# Altium project M-Mewtwo_MCUrev1.PrjPcb
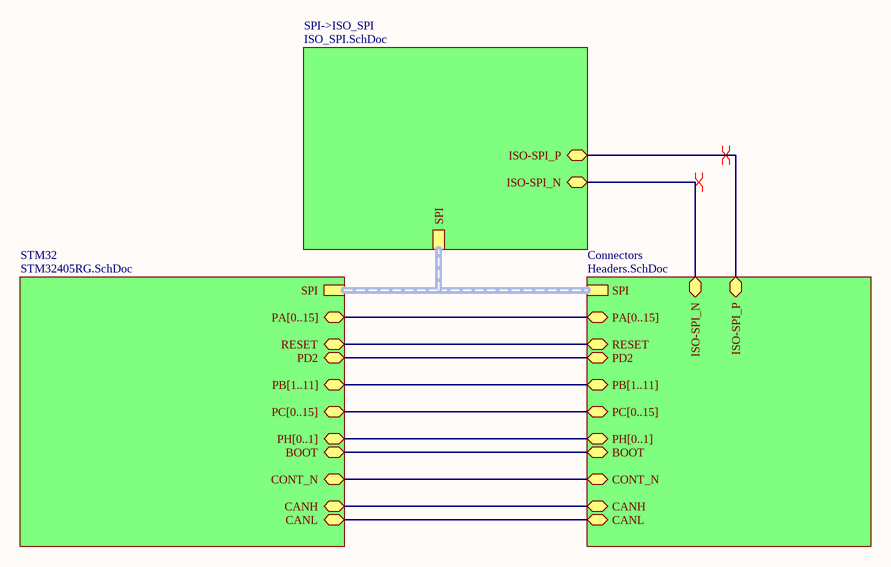
[diagram p0: MCU.SchDoc]
4 sheets, 39 parts. Net scope: hierarchical (ports join the sheet entries above them; power ports are global).
Board file: MCU.PcbDoc
Sheets:
  MCU.SchDoc
    STM32 = STM32405RG.SchDoc
    Connectors = Headers.SchDoc
    SPI->ISO_SPI = ISO_SPI.SchDoc

## Sheet MCU.SchDoc
size A

### Sub-sheets
Connectors = Headers.SchDoc: PA[0..15] (bidir), RESET (bidir), PB[1..11] (bidir), PC[0..15] (bidir), PH[0..1] (bidir), PD2 (bidir), SPI (harness SPI), BOOT (bidir), ISO-SPI_P (bidir), ISO-SPI_N (bidir), CONT_N (bidir), CANH (bidir), CANL (bidir)
SPI->ISO_SPI = ISO_SPI.SchDoc: SPI (harness SPI), ISO-SPI_N (bidir), ISO-SPI_P (bidir)
STM32 = STM32405RG.SchDoc: PA[0..15] (bidir), PB[1..11] (bidir), RESET (bidir), PC[0..15] (bidir), PH[0..1] (bidir), PD2 (bidir), SPI (harness SPI), CONT_N (bidir), BOOT (bidir), CANH (bidir), CANL (bidir)

### Nets
BOOT: sheet STM32/BOOT, sheet Connectors/BOOT
CANH: sheet STM32/CANH, sheet Connectors/CANH
CANL: sheet STM32/CANL, sheet Connectors/CANL
CONT_N: sheet STM32/CONT_N, sheet Connectors/CONT_N
ISO-SPI_N: sheet Connectors/ISO-SPI_N, sheet SPI->ISO_SPI/ISO-SPI_N
ISO-SPI_P: sheet Connectors/ISO-SPI_P, sheet SPI->ISO_SPI/ISO-SPI_P
PD2: sheet STM32/PD2, sheet Connectors/PD2
NetC13_1: sheet STM32/RESET, sheet Connectors/RESET

### Buses and harness runs
bus sheet Connectors/PA[0..15] = sheet STM32/PA[0..15]
bus sheet Connectors/PB[1..11] = sheet STM32/PB[1..11]
bus sheet Connectors/PC[0..15] = sheet STM32/PC[0..15]
bus sheet Connectors/PH[0..1] = sheet STM32/PH[0..1]
harness sheet Connectors/SPI = sheet SPI->ISO_SPI/SPI = sheet STM32/SPI

### Layout directives
differential pair: ISO-SPI_N, ISO-SPI_P

## Sheet STM32405RG.SchDoc
size A
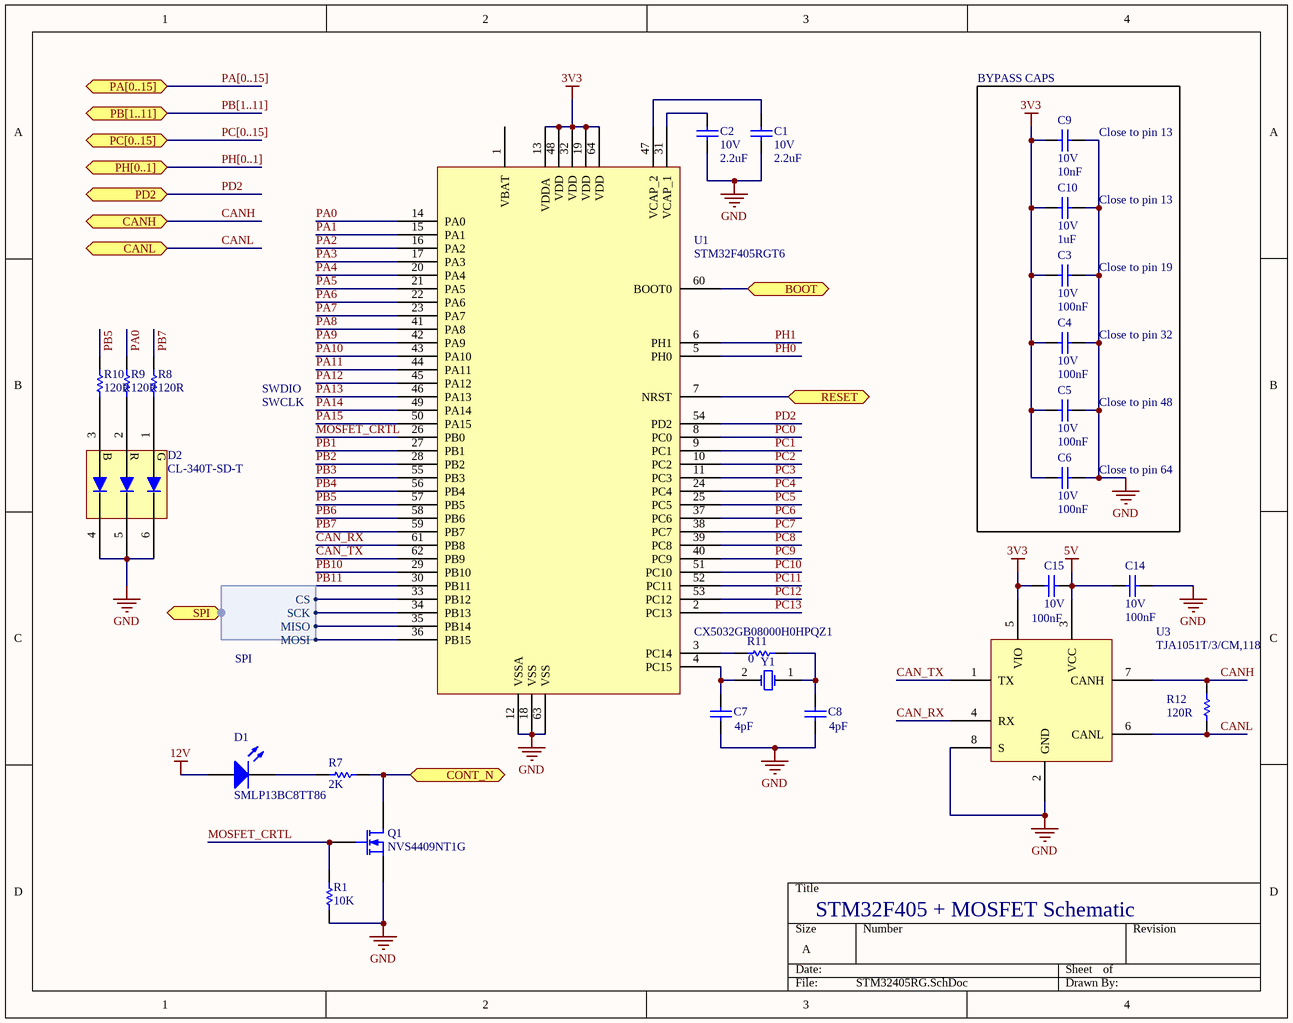
[diagram p1: STM32405RG.SchDoc]

### Parts
C1  10V  value 2.2uF  [C0805]
C2  10V  value 2.2uF  [C0805]
C3  10V  value 100nF  [C0805]
C4  10V  value 100nF  [C0805]
C5  10V  value 100nF  [C0805]
C6  10V  value 100nF  [C0805]
C7  value 4pF  [C0805]  (hidden comment: 50V)
C8  value 4pF  [C0805]  (hidden comment: 50V)
C9  10V  value 10nF  [C0805]
C10  10V  value 1uF  [C0805]
C14  10V  value 100nF  [C0805]
C15  10V  value 100nF  [C0805]
D1  SMLP13BC8TT86  [SMLP13BC8TT86]
D2  CL-340T-SD-T  [CL-340T-SD-T]
Q1  NVS4409NT1G  [NVS4409NT1G]
R1  value 10K  [J1-0603]  (hidden comment: 5%)
R7  value 2K  [J1-0603]  (hidden comment: 5%)
R8  value 120R  [J1-0603]  (hidden comment: 1%)
R9  value 120R  [J1-0603]  (hidden comment: 1%)
R10  value 120R  [J1-0603]  (hidden comment: 1%)
R11  value 0  [J1-0603]  (hidden comment: 0603)
R12  value 120R  [J1-0603]  (hidden comment: 1%)
U1  STM32F405RGT6  [STM32F405RGT6TR]
U3  TJA1051T/3/CM,118
Y1  CX5032GB08000H0HPQZ1  [CX5032GB08000H0HPQZ1]

### Ports
BOOT (bidir), CANH (bidir), CANL (bidir), CONT_N (bidir), PA[0..15] (bidir), PB[1..11] (bidir), PC[0..15] (bidir), PD2 (bidir), PH[0..1] (bidir), RESET (bidir), SPI (bidir, harness SPI)

### Harnesses
SPI: CS, SCK, MISO, MOSI

### Nets
3V3: C3.1 C4.1 C5.1 C6.1 C9.1 C10.2 C15.1 U1.13(VDDA) U1.19(VDD) U1.32(VDD) U1.48(VDD) U1.64(VDD) U3.5(VIO)
5V: C14.1 C15.2 U3.3(VCC)
12V: D1.1(A)
GND: C1.1 C2.1 C3.2 C4.2 C5.2 C6.2 C7.1 C8.1 C9.2 C10.1 C14.2 D2.4 D2.5 D2.6 Q1.3(S) R1.1 U1.12(VSSA) U1.18(VSS) U1.63(VSS) U3.2(GND) U3.8(S)
BOOT: U1.60(BOOT0) ; port BOOT
CAN_RX: U1.61(PB8) U3.4(RX)
CAN_TX: U1.62(PB9) U3.1(TX)
CANH: R12.2 U3.7(CANH) ; port CANH
CANL: R12.1 U3.6(CANL) ; port CANL
CONT_N: Q1.1(D) R7.1 ; port CONT_N
MOSFET_CRTL: Q1.2(G) R1.2 U1.26(PB0)
PA0: R9.2 U1.14(PA0)
PA1: U1.15(PA1)
PA2: U1.16(PA2)
PA3: U1.17(PA3)
PA4: U1.20(PA4)
PA5: U1.21(PA5)
PA6: U1.22(PA6)
PA7: U1.23(PA7)
PA8: U1.41(PA8)
PA9: U1.42(PA9)
PA10: U1.43(PA10)
PA11: U1.44(PA11)
PA12: U1.45(PA12)
PA13: U1.46(PA13)
PA14: U1.49(PA14)
PA15: U1.50(PA15)
PB1: U1.27(PB1)
PB2: U1.28(PB2)
PB3: U1.55(PB3)
PB4: U1.56(PB4)
PB5: R10.2 U1.57(PB5)
PB6: U1.58(PB6)
PB7: R8.2 U1.59(PB7)
PB10: U1.29(PB10)
PB11: U1.30(PB11)
PC0: U1.8(PC0)
PC1: U1.9(PC1)
PC2: U1.10(PC2)
PC3: U1.11(PC3)
PC4: U1.24(PC4)
PC5: U1.25(PC5)
PC6: U1.37(PC6)
PC7: U1.38(PC7)
PC8: U1.39(PC8)
PC9: U1.40(PC9)
PC10: U1.51(PC10)
PC11: U1.52(PC11)
PC12: U1.53(PC12)
PC13: U1.2(PC13)
PD2: U1.54(PD2) ; port PD2
PH0: U1.5(PH0)
PH1: U1.6(PH1)
NetC1_2: C1.2 U1.47(VCAP_2)
NetC2_2: C2.2 U1.31(VCAP_1)
NetC7_2: C7.2 U1.4(PC15) Y1.2(OSC2)
NetC8_2: C8.2 R11.2 Y1.1(OSC1)
NetC13_1: U1.7(NRST) ; port RESET
NetD1_2: D1.2(K) R7.2
NetD2_1: D2.1 R8.1
NetD2_2: D2.2 R9.1
NetD2_3: D2.3 R10.1
NetP1_9: U1.33(PB12) ; port SPI.CS
NetP1_10: U1.34(PB13) ; port SPI.SCK
NetP1_11: U1.35(PB14) ; port SPI.MISO
NetP1_12: U1.36(PB15) ; port SPI.MOSI
NetR11_1: R11.1 U1.3(PC14)

Not connected (* = marked no-connect by the designer): U1 1(VBAT)

### Buses and harness runs
bus PA[0..15] = port PA[0..15]
bus PB[1..11] = port PB[1..11]
bus PC[0..15] = port PC[0..15]
bus PH[0..1] = port PH[0..1]

### Notes on the sheet
- BYPASS CAPS
- (near C9) Close to pin 13
- (near C10) Close to pin 13
- (near C3) Close to pin 19
- (near C4) Close to pin 32
- SWCLK
- SWDIO
- (near C5) Close to pin 48
- (near C6) Close to pin 64
- STM32F405 + MOSFET Schematic
- (in symbol CL-340T-SD-T) B; R; G

### Library data of the parts
C1 C2 = Cap: C0805C225K8RACAUTO. 2.2µF ±10% 10V Ceramic Capacitor X7R 0805 (2012 Metric) /; Published: 8-Jun-2000; LatestRevisionDate: 17-Jul-2002; LatestRevisionNote: Re-released for DXP Platform.; PackageReference: RAD-0.3; Publisher: Altium Limited; PackageDescription: Radial Cap, Thru-Hole; 2 Leads; 0.3 in Pin Spacing
C3-C6 C14 C15 = Cap: C0805C104K8RACTU. 0.1µF ±10% 10V Ceramic Capacitor X7R 0805 (2012 Metric) /; Published: 8-Jun-2000; LatestRevisionDate: 17-Jul-2002; LatestRevisionNote: Re-released for DXP Platform.; PackageReference: RAD-0.3; Publisher: Altium Limited; PackageDescription: Radial Cap, Thru-Hole; 2 Leads; 0.3 in Pin Spacing
C7 = Cap: CBR08C409B5GAC. 4pF ±0.1pF 50V Ceramic Capacitor C0G, NP0 0805 (2012 Metric); Published: 8-Jun-2000; LatestRevisionDate: 17-Jul-2002; LatestRevisionNote: Re-released for DXP Platform.; PackageReference: RAD-0.3; Publisher: Altium Limited; PackageDescription: Radial Cap, Thru-Hole; 2 Leads; 0.3 in Pin Spacing
C8 = Cap: CBR08C409B5GAC; Published: 8-Jun-2000; LatestRevisionDate: 17-Jul-2002; LatestRevisionNote: Re-released for DXP Platform.; PackageReference: RAD-0.3; Publisher: Altium Limited; PackageDescription: Radial Cap, Thru-Hole; 2 Leads; 0.3 in Pin Spacing
C9 = Cap: C0805C103K8RAC7800. 10000pF ±10% 10V Ceramic Capacitor X7R 0805 (2012 Metric) /; Published: 8-Jun-2000; LatestRevisionDate: 17-Jul-2002; LatestRevisionNote: Re-released for DXP Platform.; PackageReference: RAD-0.3; Publisher: Altium Limited; PackageDescription: Radial Cap, Thru-Hole; 2 Leads; 0.3 in Pin Spacing
C10 = Cap: CL21B105KPFNNNE. 1µF ±10% 10V Ceramic Capacitor X7R 0805 (2012 Metric) /; Published: 8-Jun-2000; LatestRevisionDate: 17-Jul-2002; LatestRevisionNote: Re-released for DXP Platform.; PackageReference: RAD-0.3; Publisher: Altium Limited; PackageDescription: Radial Cap, Thru-Hole; 2 Leads; 0.3 in Pin Spacing
D1 = LED2: Blue 470nm LED Indication - Discrete 2.9V 2-SMD, No Lead; Published: 8-Jun-2000; LatestRevisionDate: 17-Jul-2002; LatestRevisionNote: Re-released for DXP Platform.; PackageVersion: Feb-2002; PackageReference: 3.2X1.6X1.1; Publisher: Altium Limited; PackageDescription: SM LED; 2 Flat Leads
Q1 = MOSFET-N: N-Channel 25V 700mA (Ta) 280mW (Tj) Surface Mount SC-70-3 (SOT323); Published: 8-Jun-2000; LatestRevisionDate: 17-Jul-2002; LatestRevisionNote: Re-released for DXP Platform.; PackageVersion: 1995/1996; PackageReference: E3; Publisher: Altium Limited; PackageDescription: TO, Flat Index; 3 In-Line, Axial Leads; Body Dia. 4.6mm; Lead Dia. 0.5 mm (max)
R1 = Res1: ERJ-3GEYJ103V. 10 kOhms ±5% 0.1W, 1/10W Chip Resistor 0603 (1608 Metric) Automotive AEC-Q200 Thick Film /; Published: 8-Jun-2000; LatestRevisionDate: 17-Jul-2002; LatestRevisionNote: Re-released for DXP Platform.; PackageReference: AXIAL-0.3; Publisher: Altium Limited; PackageDescription: Axial Device, Thru-Hole; 2 Leads; 0.3 in Pin Spacing
R7 = Res1: ERJ-PA3J202V. 2 kOhms ±5% 0.25W, 1/4W Chip Resistor 0603 (1608 Metric) Automotive AEC-Q200, Pulse Withstanding Thick Film /; Published: 8-Jun-2000; LatestRevisionDate: 17-Jul-2002; LatestRevisionNote: Re-released for DXP Platform.; PackageReference: AXIAL-0.3; Publisher: Altium Limited; PackageDescription: Axial Device, Thru-Hole; 2 Leads; 0.3 in Pin Spacing
R8-R10 R12 = Res1: RC0603FR-07120RL. 120 Ohms ±1% 0.1W, 1/10W Chip Resistor 0603 (1608 Metric) Moisture Resistant Thick Film /; Published: 8-Jun-2000; LatestRevisionDate: 17-Jul-2002; LatestRevisionNote: Re-released for DXP Platform.; PackageReference: AXIAL-0.3; Publisher: Altium Limited; PackageDescription: Axial Device, Thru-Hole; 2 Leads; 0.3 in Pin Spacing
R11 = Res1: ERJ-U030R00V. 0 Ohms Jumper 0.1W, 1/10W Chip Resistor 0603 (1608 Metric) Anti-Sulfur, Automotive AEC-Q200 Thick Film; Published: 8-Jun-2000; LatestRevisionDate: 17-Jul-2002; LatestRevisionNote: Re-released for DXP Platform.; PackageReference: AXIAL-0.3; Publisher: Altium Limited; PackageDescription: Axial Device, Thru-Hole; 2 Leads; 0.3 in Pin Spacing
U1 = STM32F405RGT6TR
U3 = TJA1050T/CM,118
Y1 = XTAL: 8MHz ±20ppm Crystal 12pF 300 Ohms 2-SMD, No Lead /; Published: 8-Jun-2000; LatestRevisionDate: 17-Jul-2002; LatestRevisionNote: Re-released for DXP Platform.; PackageReference: R38; Publisher: Altium Limited; PackageDescription: Crystal, Thru-Hole; 2 Leads; Body 3.1 x 8.2 mm (Dia.xH)

## Sheet Headers.SchDoc
size A
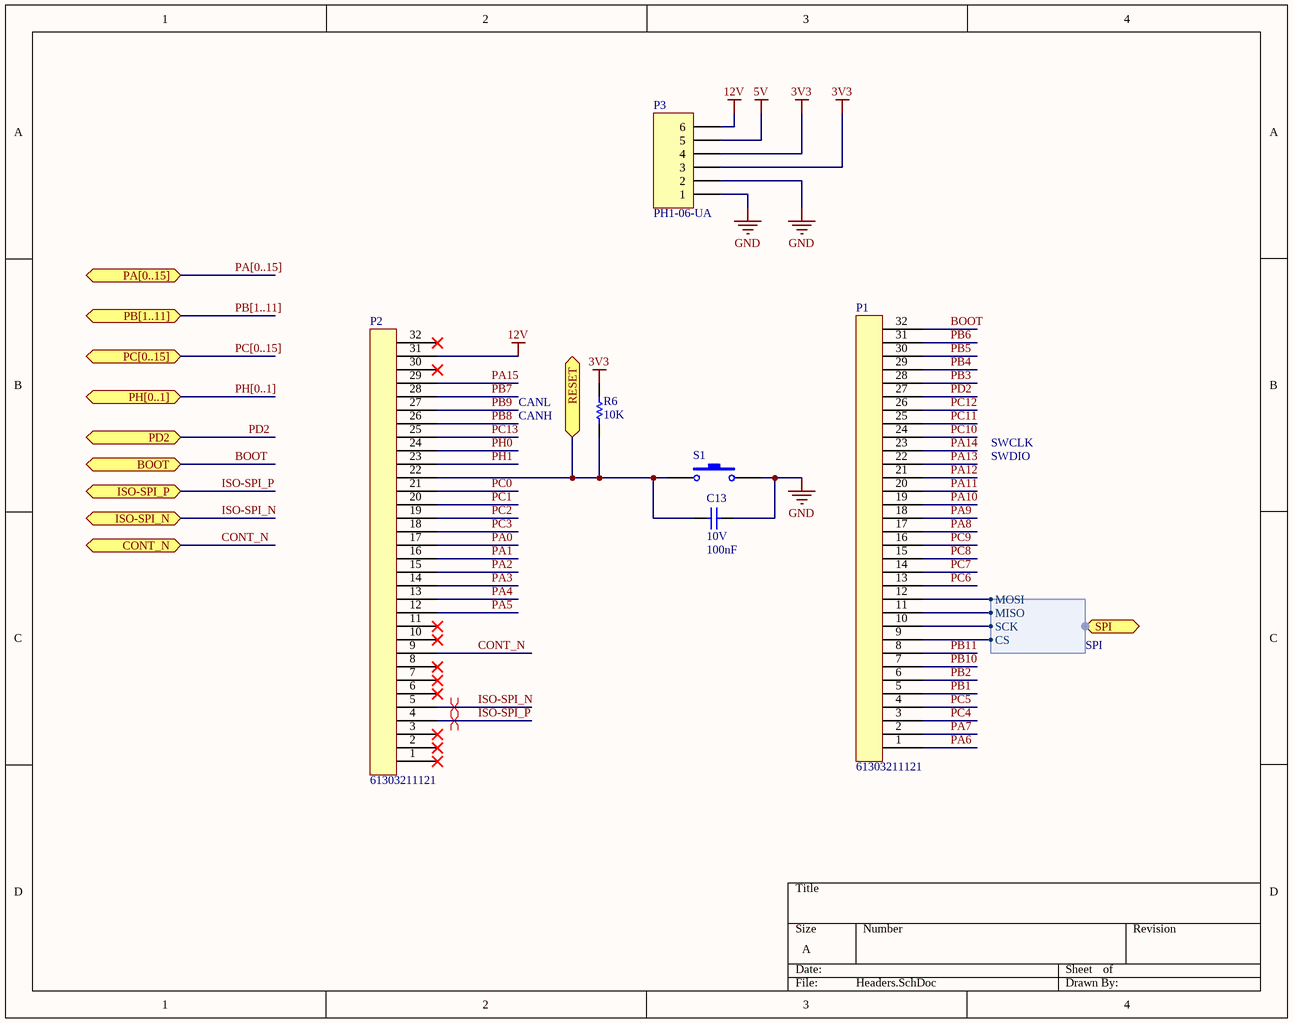
[diagram p2: Headers.SchDoc]

### Parts
C13  10V  value 100nF  [C0805]
P1  61303211121  [61303211121]
P2  61303211121  [61303211121]
P3  PH1-06-UA  [PH1-06-UA]
R6  value 10K  [J1-0603]  (hidden comment: 5%)
S1  PTS636 SM43 SMTR LFS  [PTS636 SM43 SMTR LFS]  (value not drawn)

### Ports
BOOT (bidir), CONT_N (bidir), ISO-SPI_N (bidir), ISO-SPI_P (bidir), PA[0..15] (bidir), PB[1..11] (bidir), PC[0..15] (bidir), PD2 (bidir), PH[0..1] (bidir), RESET (bidir), SPI (bidir, harness SPI)

### Harnesses
SPI: CS, SCK, MISO, MOSI

### Nets
3V3: P3.3 P3.4 R6.2
5V: P3.5
12V: P2.31 P3.6
GND: C13.2 P3.1 P3.2 S1.2
BOOT: P1.32 ; port BOOT
CONT_N: P2.9 ; port CONT_N
ISO-SPI_N: P2.5 ; port ISO-SPI_N
ISO-SPI_P: P2.4 ; port ISO-SPI_P
PA0: P2.17
PA1: P2.16
PA2: P2.15
PA3: P2.14
PA4: P2.13
PA5: P2.12
PA6: P1.1
PA7: P1.2
PA8: P1.17
PA9: P1.18
PA10: P1.19
PA11: P1.20
PA12: P1.21
PA13: P1.22
PA14: P1.23
PA15: P2.29
PB1: P1.5
PB2: P1.6
PB3: P1.28
PB4: P1.29
PB5: P1.30
PB6: P1.31
PB7: P2.28
PB8: P2.26
PB9: P2.27
PB10: P1.7
PB11: P1.8
PC0: P2.21
PC1: P2.20
PC2: P2.19
PC3: P2.18
PC4: P1.3
PC5: P1.4
PC6: P1.13
PC7: P1.14
PC8: P1.15
PC9: P1.16
PC10: P1.24
PC11: P1.25
PC12: P1.26
PC13: P2.25
PD2: P1.27 ; port PD2
PH0: P2.24
PH1: P2.23
NetC13_1: C13.1 P2.22 R6.1 S1.1 ; port RESET
NetP1_9: P1.9 ; port SPI.CS
NetP1_10: P1.10 ; port SPI.SCK
NetP1_11: P1.11 ; port SPI.MISO
NetP1_12: P1.12 ; port SPI.MOSI

Not connected (* = marked no-connect by the designer): P2 1* 2* 3* 6* 7* 8* 10* 11* 30* 32*

### Buses and harness runs
bus PA[0..15] = port PA[0..15]
bus PB[1..11] = port PB[1..11]
bus PC[0..15] = port PC[0..15]
bus PH[0..1] = port PH[0..1]

### Layout directives
differential pair: ISO-SPI_N, ISO-SPI_P

### Notes on the sheet
- CANH
- CANL
- SWDIO
- SWCLK

### Library data of the parts
C13 = Cap: as C3 on sheet STM32405RG; Published: 8-Jun-2000; LatestRevisionDate: 17-Jul-2002; LatestRevisionNote: Re-released for DXP Platform.; PackageReference: RAD-0.3; Publisher: Altium Limited; PackageDescription: Radial Cap, Thru-Hole; 2 Leads; 0.3 in Pin Spacing
P3 = Header 6: Connector Header Through Hole 6 position 0.100" (2.54mm); LatestRevisionDate: 17-Jul-2002; LatestRevisionNote: Re-released for DXP Platform.; Publisher: Altium Limited
R6 = Res1: as R1 on sheet STM32405RG; Published: 8-Jun-2000; LatestRevisionDate: 17-Jul-2002; LatestRevisionNote: Re-released for DXP Platform.; PackageReference: AXIAL-0.3; Publisher: Altium Limited; PackageDescription: Axial Device, Thru-Hole; 2 Leads; 0.3 in Pin Spacing
S1 = SW-PB: Tactile Switch SPST-NO Top Actuated Surface Mount; Published: 24-Mar-1999; LatestRevisionDate: 17-Jul-2002; LatestRevisionNote: Re-released for DXP Platform.; PackageReference: SPST-2; Publisher: Altium Limited; PackageDescription: Switch; 2 Leads

## Sheet ISO_SPI.SchDoc
size A
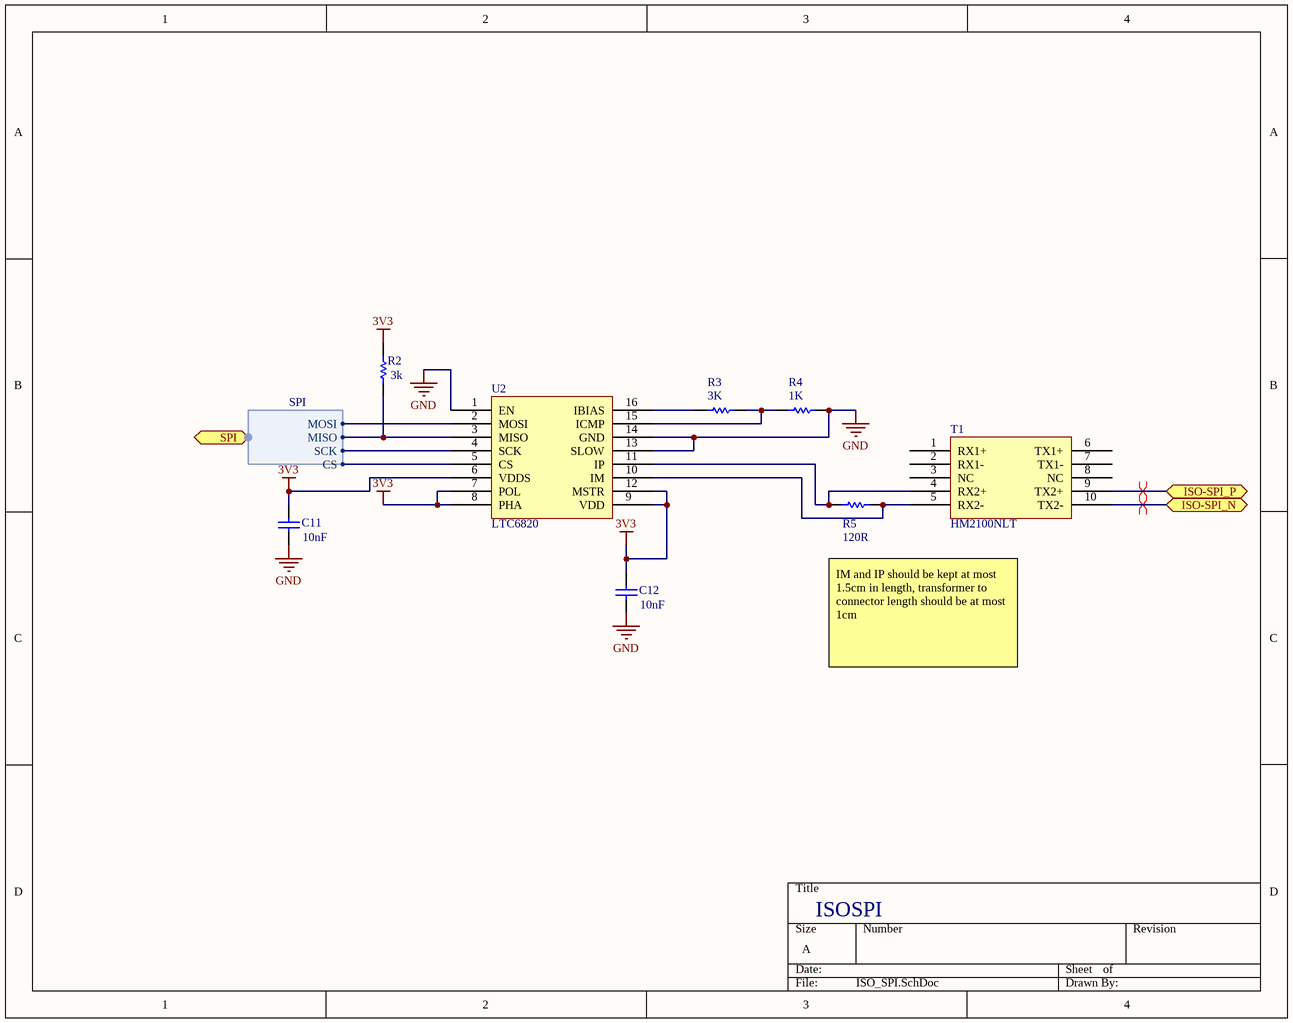
[diagram p3: ISO_SPI.SchDoc]

### Parts
C11  value 10nF  [C0805]  (hidden comment: 10V)
C12  value 10nF  [C0805]  (hidden comment: 10V)
R2  value 3k  [J1-0603]  (hidden comment: 1%)
R3  value 3K  [J1-0603]  (hidden comment: 1%)
R4  value 1K  [J1-0603]  (hidden comment: 1%)
R5  value 120R  [J1-0603]  (hidden comment: 1%)
T1  HM2100NLT  [HM2100NLT]
U2  LTC6820  [LTC6820]

### Ports
ISO-SPI_N (bidir), ISO-SPI_P (bidir), SPI (bidir, harness SPI)

### Harnesses
SPI: MOSI, MISO, SCK, CS

### Nets
3V3: C11.1 C12.1 R2.2 U2.6(VDDS) U2.7(POL) U2.8(PHA) U2.9(VDD) U2.12(MSTR)
GND: C11.2 C12.2 R4.2 U2.1(EN) U2.13(SLOW) U2.14(GND)
ISO-SPI_N: T1.10(TX2-) ; port ISO-SPI_N
ISO-SPI_P: T1.9(TX2+) ; port ISO-SPI_P
NetP1_9: U2.5(CS) ; port SPI.CS
NetP1_10: U2.4(SCK) ; port SPI.SCK
NetP1_11: R2.1 U2.3(MISO) ; port SPI.MISO
NetP1_12: U2.2(MOSI) ; port SPI.MOSI
NetR3_1: R3.1 U2.16(IBIAS)
NetR3_2: R3.2 R4.1 U2.15(ICMP)
NetR5_1: R5.1 T1.4(RX2+) U2.11(IP)
NetR5_2: R5.2 T1.5(RX2-) U2.10(IM)

Not connected (* = marked no-connect by the designer): T1 1(RX1+) 2(RX1-) 3(NC) 6(TX1+) 7(TX1-) 8(NC)

### Layout directives
differential pair: ISO-SPI_N, ISO-SPI_P

### Notes on the sheet
- IM and IP should be kept at most 1.5cm in length, transformer to connector length should be at most 1cm
- ISOSPI

### Library data of the parts
C11 C12 = Cap: as C9 on sheet STM32405RG; Published: 8-Jun-2000; LatestRevisionDate: 17-Jul-2002; LatestRevisionNote: Re-released for DXP Platform.; PackageReference: RAD-0.3; Publisher: Altium Limited; PackageDescription: Radial Cap, Thru-Hole; 2 Leads; 0.3 in Pin Spacing
R2 R3 = Res1: RMCF0603FT3K00. 3 kOhms ±1% 0.1W, 1/10W Chip Resistor 0603 (1608 Metric) Automotive AEC-Q200 Thick Film /; Published: 8-Jun-2000; LatestRevisionDate: 17-Jul-2002; LatestRevisionNote: Re-released for DXP Platform.; PackageReference: AXIAL-0.3; Publisher: Altium Limited; PackageDescription: Axial Device, Thru-Hole; 2 Leads; 0.3 in Pin Spacing
R4 = Res1: RC0603FR-071KL .1 kOhms ±1% 0.1W, 1/10W Chip Resistor 0603 (1608 Metric) Moisture Resistant Thick Film /; Published: 8-Jun-2000; LatestRevisionDate: 17-Jul-2002; LatestRevisionNote: Re-released for DXP Platform.; PackageReference: AXIAL-0.3; Publisher: Altium Limited; PackageDescription: Axial Device, Thru-Hole; 2 Leads; 0.3 in Pin Spacing
R5 = Res1: as R8 on sheet STM32405RG; Published: 8-Jun-2000; LatestRevisionDate: 17-Jul-2002; LatestRevisionNote: Re-released for DXP Platform.; PackageReference: AXIAL-0.3; Publisher: Altium Limited; PackageDescription: Axial Device, Thru-Hole; 2 Leads; 0.3 in Pin Spacing

## Nets that join several sheets
3V3: STM32405RG (13 pins), Headers (P3.3 P3.4 R6.2), ISO_SPI (8 pins)
5V: STM32405RG (C14.1 C15.2 U3.3), Headers (P3.5)
12V: STM32405RG (D1.1), Headers (P2.31 P3.6)
GND: STM32405RG (21 pins), Headers (C13.2 P3.1 P3.2 S1.2), ISO_SPI (6 pins)
BOOT: STM32405RG (U1.60), Headers (P1.32)
CONT_N: STM32405RG (Q1.1 R7.1), Headers (P2.9)
ISO-SPI_N: Headers (P2.5), ISO_SPI (T1.10)
ISO-SPI_P: Headers (P2.4), ISO_SPI (T1.9)
NetC13_1: STM32405RG (U1.7), Headers (C13.1 P2.22 R6.1 S1.1)
NetP1_9: STM32405RG (U1.33), Headers (P1.9), ISO_SPI (U2.5)
NetP1_10: STM32405RG (U1.34), Headers (P1.10), ISO_SPI (U2.4)
NetP1_11: STM32405RG (U1.35), Headers (P1.11), ISO_SPI (R2.1 U2.3)
NetP1_12: STM32405RG (U1.36), Headers (P1.12), ISO_SPI (U2.2)
PA0: STM32405RG (R9.2 U1.14), Headers (P2.17)
PA1: STM32405RG (U1.15), Headers (P2.16)
PA2: STM32405RG (U1.16), Headers (P2.15)
PA3: STM32405RG (U1.17), Headers (P2.14)
PA4: STM32405RG (U1.20), Headers (P2.13)
PA5: STM32405RG (U1.21), Headers (P2.12)
PA6: STM32405RG (U1.22), Headers (P1.1)
PA7: STM32405RG (U1.23), Headers (P1.2)
PA8: STM32405RG (U1.41), Headers (P1.17)
PA9: STM32405RG (U1.42), Headers (P1.18)
PA10: STM32405RG (U1.43), Headers (P1.19)
PA11: STM32405RG (U1.44), Headers (P1.20)
PA12: STM32405RG (U1.45), Headers (P1.21)
PA13: STM32405RG (U1.46), Headers (P1.22)
PA14: STM32405RG (U1.49), Headers (P1.23)
PA15: STM32405RG (U1.50), Headers (P2.29)
PB1: STM32405RG (U1.27), Headers (P1.5)
PB2: STM32405RG (U1.28), Headers (P1.6)
PB3: STM32405RG (U1.55), Headers (P1.28)
PB4: STM32405RG (U1.56), Headers (P1.29)
PB5: STM32405RG (R10.2 U1.57), Headers (P1.30)
PB6: STM32405RG (U1.58), Headers (P1.31)
PB7: STM32405RG (R8.2 U1.59), Headers (P2.28)
PB10: STM32405RG (U1.29), Headers (P1.7)
PB11: STM32405RG (U1.30), Headers (P1.8)
PC0: STM32405RG (U1.8), Headers (P2.21)
PC1: STM32405RG (U1.9), Headers (P2.20)
PC2: STM32405RG (U1.10), Headers (P2.19)
PC3: STM32405RG (U1.11), Headers (P2.18)
PC4: STM32405RG (U1.24), Headers (P1.3)
PC5: STM32405RG (U1.25), Headers (P1.4)
PC6: STM32405RG (U1.37), Headers (P1.13)
PC7: STM32405RG (U1.38), Headers (P1.14)
PC8: STM32405RG (U1.39), Headers (P1.15)
PC9: STM32405RG (U1.40), Headers (P1.16)
PC10: STM32405RG (U1.51), Headers (P1.24)
PC11: STM32405RG (U1.52), Headers (P1.25)
PC12: STM32405RG (U1.53), Headers (P1.26)
PC13: STM32405RG (U1.2), Headers (P2.25)
PD2: STM32405RG (U1.54), Headers (P1.27)
PH0: STM32405RG (U1.5), Headers (P2.24)
PH1: STM32405RG (U1.6), Headers (P2.23)